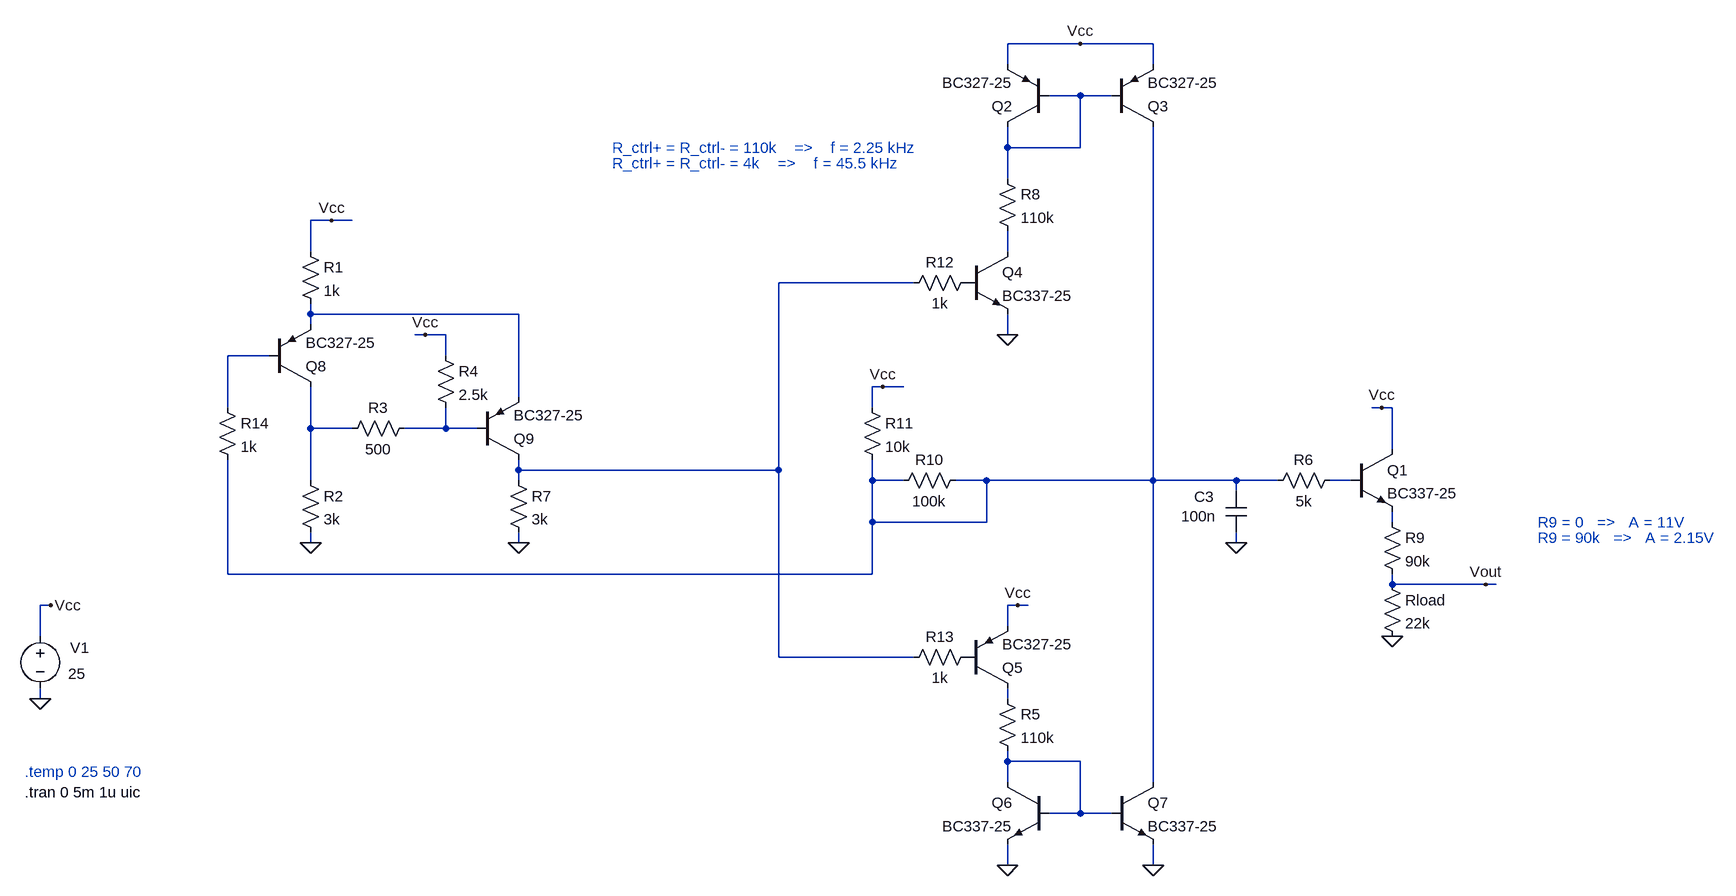
[diagram p0: schematic Proiect1_v5.asc]
Proiect1_v5.asc, the LTspice schematic file:
Version 4
SHEET 1 2096 956
WIRE 1088 -928 976 -928
WIRE 1200 -928 1088 -928
WIRE 976 -896 976 -928
WIRE 1200 -896 1200 -928
WIRE 1088 -848 1040 -848
WIRE 1136 -848 1088 -848
WIRE 976 -768 976 -800
WIRE 1088 -768 1088 -848
WIRE 1088 -768 976 -768
WIRE 976 -720 976 -768
WIRE -64 -656 -96 -656
WIRE -32 -656 -64 -656
WIRE -96 -608 -96 -656
WIRE 976 -608 976 -640
WIRE 832 -560 624 -560
WIRE -96 -512 -96 -528
WIRE 224 -512 -96 -512
WIRE -96 -496 -96 -512
WIRE 80 -480 64 -480
WIRE 112 -480 80 -480
WIRE 976 -480 976 -512
WIRE -160 -448 -224 -448
WIRE 112 -448 112 -480
WIRE 784 -400 768 -400
WIRE 816 -400 784 -400
WIRE 224 -384 224 -512
WIRE -224 -368 -224 -448
WIRE 768 -368 768 -400
WIRE 1552 -368 1536 -368
WIRE 1568 -368 1552 -368
WIRE -96 -336 -96 -400
WIRE -32 -336 -96 -336
WIRE 112 -336 112 -368
WIRE 112 -336 48 -336
WIRE 160 -336 112 -336
WIRE 1568 -304 1568 -368
WIRE 224 -272 224 -288
WIRE 624 -272 624 -560
WIRE 624 -272 224 -272
WIRE -96 -256 -96 -336
WIRE 224 -256 224 -272
WIRE 768 -256 768 -288
WIRE 816 -256 768 -256
WIRE 944 -256 896 -256
WIRE 1200 -256 1200 -800
WIRE 1200 -256 944 -256
WIRE 1328 -256 1200 -256
WIRE 1392 -256 1328 -256
WIRE 1504 -256 1472 -256
WIRE 1328 -240 1328 -256
WIRE 768 -192 768 -256
WIRE 944 -192 944 -256
WIRE 944 -192 768 -192
WIRE 1568 -192 1568 -208
WIRE -96 -160 -96 -176
WIRE 224 -160 224 -176
WIRE 1328 -160 1328 -176
WIRE -224 -112 -224 -288
WIRE 768 -112 768 -192
WIRE 768 -112 -224 -112
WIRE 1568 -96 1568 -112
WIRE 1712 -96 1568 -96
WIRE 1728 -96 1712 -96
WIRE -496 -64 -512 -64
WIRE 992 -64 976 -64
WIRE 1008 -64 992 -64
WIRE 976 -32 976 -64
WIRE -512 -16 -512 -64
WIRE 624 16 624 -272
WIRE 832 16 624 16
WIRE -512 80 -512 64
WIRE 976 80 976 64
WIRE 976 176 976 160
WIRE 1088 176 976 176
WIRE 976 208 976 176
WIRE 1200 208 1200 -256
WIRE 1088 256 1088 176
WIRE 1088 256 1040 256
WIRE 1136 256 1088 256
WIRE 976 336 976 304
WIRE 1200 336 1200 304
FLAG -512 80 0
FLAG -496 -64 Vcc
FLAG 976 336 0
FLAG 1200 336 0
FLAG 1328 -160 0
FLAG 1568 -16 0
FLAG 1088 -928 Vcc
FLAG 976 -480 0
FLAG 992 -64 Vcc
FLAG 1552 -368 Vcc
FLAG 1712 -96 Vout
FLAG -64 -656 Vcc
FLAG 80 -480 Vcc
FLAG -96 -160 0
FLAG 224 -160 0
FLAG 784 -400 Vcc
SYMBOL voltage -512 -32 R0
WINDOW 0 46 33 Left 2
WINDOW 3 43 73 Left 2
WINDOW 123 0 0 Left 0
WINDOW 39 0 0 Left 0
SYMATTR InstName V1
SYMATTR Value 25
SYMBOL res 960 64 R0
SYMATTR InstName R5
SYMATTR Value 110k
SYMBOL cap 1344 -176 R180
WINDOW 0 50 55 Left 2
WINDOW 3 47 25 Left 2
SYMATTR InstName C3
SYMATTR Value 100n
SYMBOL res 1552 -112 R0
SYMATTR InstName Rload
SYMATTR Value 22k
SYMBOL res 960 -736 R0
SYMATTR InstName R8
SYMATTR Value 110k
SYMBOL res 1552 -208 R0
SYMATTR InstName R9
SYMATTR Value 90k
SYMBOL npn 1504 -304 R0
SYMATTR InstName Q1
SYMATTR Value BC337-25
SYMBOL res 1488 -272 R90
WINDOW 0 0 56 VBottom 2
WINDOW 3 32 56 VTop 2
SYMATTR InstName R6
SYMATTR Value 5k
SYMBOL pnp 1040 -800 R180
SYMATTR InstName Q2
SYMATTR Value BC327-25
SYMBOL pnp 1136 -800 M180
SYMATTR InstName Q3
SYMATTR Value BC327-25
SYMBOL npn 912 -608 R0
SYMATTR InstName Q4
SYMATTR Value BC337-25
SYMBOL pnp 912 64 M180
SYMATTR InstName Q5
SYMATTR Value BC327-25
SYMBOL npn 1040 208 M0
SYMATTR InstName Q6
SYMATTR Value BC337-25
SYMBOL npn 1136 208 R0
SYMATTR InstName Q7
SYMATTR Value BC337-25
SYMBOL res 912 -272 R90
WINDOW 0 0 56 VBottom 2
WINDOW 3 32 56 VTop 2
SYMATTR InstName R10
SYMATTR Value 100k
SYMBOL res 752 -384 R0
SYMATTR InstName R11
SYMATTR Value 10k
SYMBOL res 928 -576 R90
WINDOW 0 0 56 VBottom 2
WINDOW 3 32 56 VTop 2
SYMATTR InstName R12
SYMATTR Value 1k
SYMBOL res 928 0 R90
WINDOW 0 0 56 VBottom 2
WINDOW 3 32 56 VTop 2
SYMATTR InstName R13
SYMATTR Value 1k
SYMBOL pnp -160 -400 M180
SYMATTR InstName Q8
SYMATTR Value BC327-25
SYMBOL pnp 160 -288 M180
SYMATTR InstName Q9
SYMATTR Value BC327-25
SYMBOL res -112 -624 R0
SYMATTR InstName R1
SYMATTR Value 1k
SYMBOL res -112 -272 R0
SYMATTR InstName R2
SYMATTR Value 3k
SYMBOL res 64 -352 R90
WINDOW 0 0 56 VBottom 2
WINDOW 3 32 56 VTop 2
SYMATTR InstName R3
SYMATTR Value 500
SYMBOL res 96 -464 R0
SYMATTR InstName R4
SYMATTR Value 2.5k
SYMBOL res 208 -272 R0
SYMATTR InstName R7
SYMATTR Value 3k
SYMBOL res -240 -384 R0
SYMATTR InstName R14
SYMATTR Value 1k
TEXT -536 224 Left 2 !.tran 0 5m 1u uic
TEXT 368 -768 Left 2 ;R_ctrl+ = R_ctrl- = 110k    =>    f = 2.25 kHz
TEXT 368 -744 Left 2 ;R_ctrl+ = R_ctrl- = 4k    =>    f = 45.5 kHz
TEXT 1792 -192 Left 2 ;R9 = 0   =>   A = 11V
TEXT 1792 -168 Left 2 ;R9 = 90k   =>   A = 2.15V
TEXT -536 192 Left 2 ;.temp 0 25 50 70

The netlist it stands for:
* Proiect1_v5.asc
V1 Vcc 0 25
R5 N011 N012 110k
C3 0 N008 100n
Rload Vout 0 22k
R8 N001 N002 110k
R9 N010 Vout 90k
Q1 Vcc N009 N010 0 BC337-25
R6 N009 N008 5k
Q2 N001 N001 Vcc 0 BC327-25
Q3 N008 N001 Vcc 0 BC327-25
Q4 N002 P001 0 0 BC337-25
Q5 N011 P002 Vcc 0 BC327-25
Q6 N012 N012 0 0 BC337-25
Q7 N008 N012 0 0 BC337-25
R10 N008 N008 100k
R11 Vcc N008 10k
R12 P001 N003 1k
R13 P002 N003 1k
Q8 N006 N005 N004 0 BC327-25
Q9 N003 N007 N004 0 BC327-25
R1 Vcc N004 1k
R2 N006 0 3k
R3 N007 N006 500
R4 Vcc N007 2.5k
R7 N003 0 3k
R14 N005 N008 1k
.model NPN NPN
.model PNP PNP
.lib standard.bjt
.tran 0 5m 1u uic
* R_ctrl+ = R_ctrl- = 110k    =>    f = 2.25 kHz
* R_ctrl+ = R_ctrl- = 4k    =>    f = 45.5 kHz
* R9 = 0   =>   A = 11V
* R9 = 90k   =>   A = 2.15V
* .temp 0 25 50 70
.backanno
.end